# EAGLE design CYPRESS_SRAM_DB (EAGLE 9.6.2)
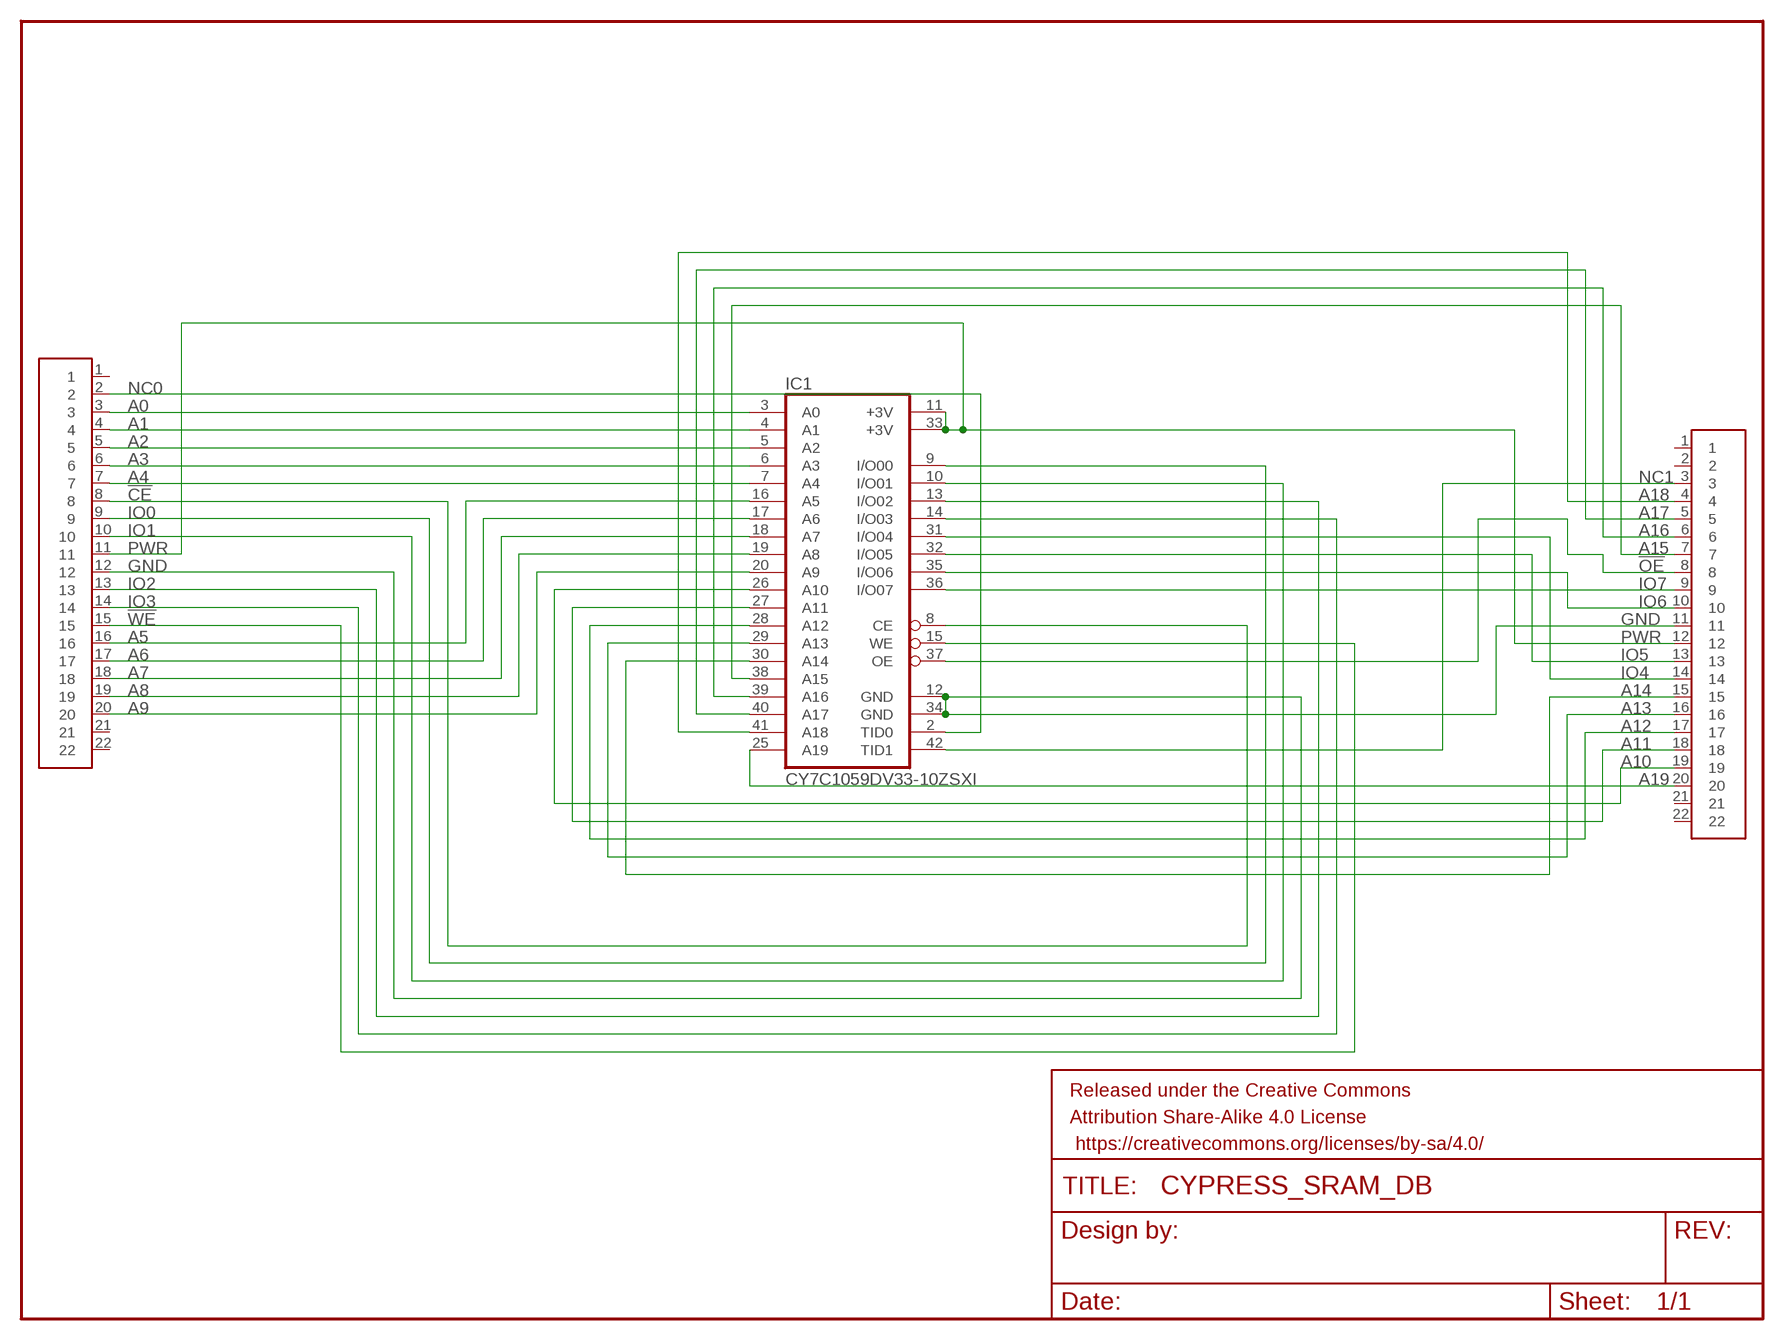
[diagram p0: schematic, sheet 1]

## Parts
FRAME1  FRAME-LETTERNO_PACKAGE  [DUMMY]
IC1  CY7C1059DV33-10ZSXI  [TSOPII-Z44]
U$1  1X22THM  [1X22]
U$2  1X22THM  [1X22]

## Nets
!CE: IC1.8(CE) U$2.8
!OE: IC1.37(OE) U$1.8
!WE: IC1.15(WE) U$2.15
A0: IC1.3(A0) U$2.3
A1: IC1.4(A1) U$2.4
A2: IC1.5(A2) U$2.5
A3: IC1.6(A3) U$2.6
A4: IC1.7(A4) U$2.7
A5: IC1.16(A5) U$2.16
A6: IC1.17(A6) U$2.17
A7: IC1.18(A7) U$2.18
A8: IC1.19(A8) U$2.19
A9: IC1.20(A9) U$2.20
A10: IC1.26(A10) U$1.19
A11: IC1.27(A11) U$1.18
A12: IC1.28(A12) U$1.17
A13: IC1.29(A13) U$1.16
A14: IC1.30(A14) U$1.15
A15: IC1.38(A15) U$1.7
A16: IC1.39(A16) U$1.6
A17: IC1.40(A17) U$1.5
A18: IC1.41(A18) U$1.4
A19: IC1.25(A19) U$1.20
GND: IC1.12(GND) IC1.34(GND) U$1.11 U$2.12
IO0: IC1.9(I/O00) U$2.9
IO1: IC1.10(I/O01) U$2.10
IO2: IC1.13(I/O02) U$2.13
IO3: IC1.14(I/O03) U$2.14
IO4: IC1.31(I/O04) U$1.14
IO5: IC1.32(I/O05) U$1.13
IO6: IC1.35(I/O06) U$1.10
IO7: IC1.36(I/O07) U$1.9
NC0: IC1.2(TID0) U$2.2
NC1: IC1.42(TID1) U$1.3
PWR: IC1.11(+3V) IC1.33(+3V) U$1.12 U$2.11
Unconnected: U$1.1 U$1.2 U$1.21 U$1.22 U$2.1 U$2.21 U$2.22

## Library data of the parts
FRAME1 = SparkFun-Aesthetics:FRAME-LETTER: Schematic Frame - Letter Standard 8.5x11 US Letter frame; DESIGNER: Nobody; VERSION: v01
IC1 = CYPRESS_SRAM_TID:CY7C1059DV33: Source: CYPRESS cy7c1059dv33_8.pdf
U$1 U$2 = adafruit:1X22

## Board
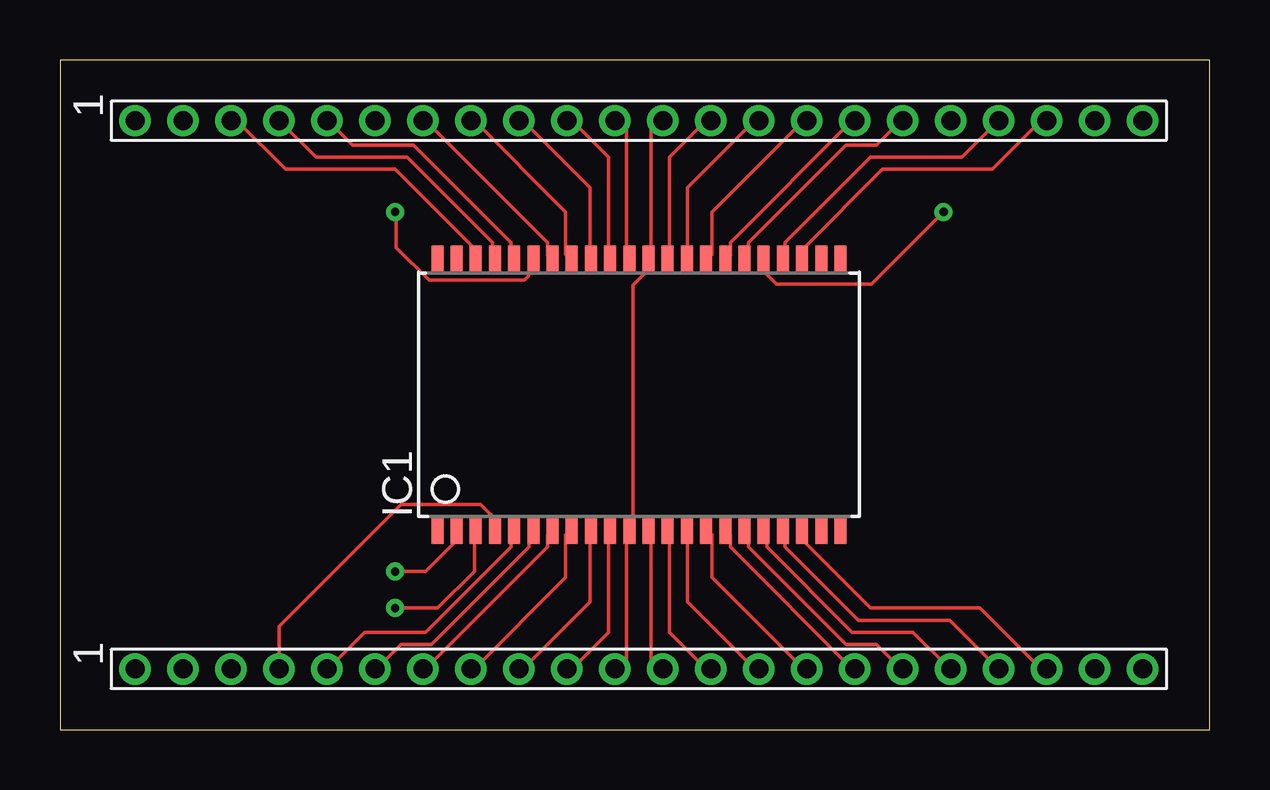
[diagram p1: board, top side]
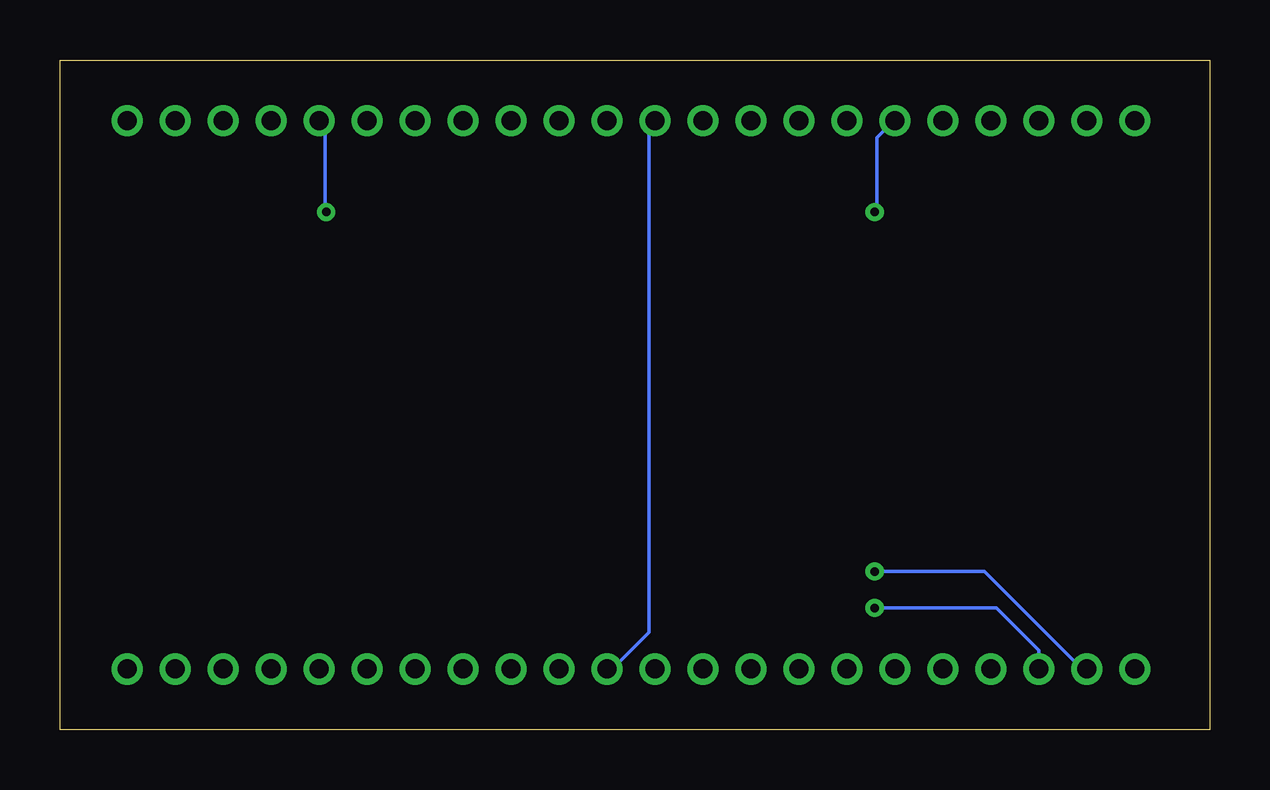
[diagram p2: board, bottom side, seen from below]

Size 47.93 x 27.93 mm. Coordinates in mm from the lower left corner, seen from the top.
Outline: 0,0 47.93,0 47.93,27.93 0,27.93 0,0
Copper layers (1*16): Top 0.035mm / dielectric 1.5mm / Bottom 0.035mm
Design rules "default": minimum track width 6mil, minimum drill 0.35mm, track to track 6mil, track to pad 6mil, pad to pad 6mil, via to via 6mil, smd to smd 6mil, copper to edge 40mil, drill to drill 6mil, minimum pad ring 10mil, minimum via ring 8mil, stop-mask expansion 4mil, vias tented up to drill 0mil, thermal gap 10mil

### Footprints (pad centres in the part's own frame; a part is rotated, then mirrored left to right if it is on the bottom)
TSOPII-Z44 = smd 0.5 x 1.2: 1 -8.4,-5.627; 2 -7.6,-5.627; 3 -6.8,-5.627; 4 -6,-5.627; 5 -5.2,-5.627; 6 -4.4,-5.627; 7 -3.6,-5.627; 8 -2.8,-5.627; 9 -2,-5.627; 10 -1.2,-5.627; 11 -0.4,-5.627; 12 0.4,-5.627; 13 1.2,-5.627; 14 2,-5.627; 15 2.8,-5.627; 16 3.6,-5.627; 17 4.4,-5.627; 18 5.2,-5.627; 19 6,-5.627; 20 6.8,-5.627; 21 7.6,-5.627; 22 8.4,-5.627; 23 8.4,5.627; 24 7.6,5.627; 25 6.8,5.627; 26 6,5.627; 27 5.2,5.627; 28 4.4,5.627; 29 3.6,5.627; 30 2.8,5.627; 31 2,5.627; 32 1.2,5.627; 33 0.4,5.627; 34 -0.4,5.627; 35 -1.2,5.627; 36 -2,5.627; 37 -2.8,5.627; 38 -3.6,5.627; 39 -4.4,5.627; 40 -5.2,5.627; 41 -6,5.627; 42 -6.8,5.627; 43 -7.6,5.627; 44 -8.4,5.627
1X22 = drill 0.8: 1 -21,0; 2 -19,0; 3 -17,0; 4 -15,0; 5 -13,0; 6 -11,0; 7 -9,0; 8 -7,0; 9 -5,0; 10 -3,0; 11 -1,0; 12 1,0; 13 3,0; 14 5,0; 15 7,0; 16 9,0; 17 11,0; 18 13,0; 19 15,0; 20 17,0; 21 19,0; 22 21,0

### Placement (x,y rotation side)
FRAME1  -13.97,29.21 0 top  (outside the outline)
IC1  24.13,13.97 0 top
U$1  24.13,25.4 0 top
U$2  24.13,2.54 0 top

### Tracks (layer width: path | path; a pad name or v marks a point on that pad's centre or on a via)
!CE
  Top 0.152: IC1.8 21.08,8.13 21.08,6.35 17.27,2.54 U$2.8
!OE
  Top 0.152: IC1.37 21.08,19.81 21.08,21.59 17.27,25.4 U$1.8
!WE
  Top 0.152: IC1.15 27.18,8.13 27.18,6.35 30.99,2.54 U$2.15
A0  (via drill 0.35)
  Top 0.152: IC1.3 17.27,8.13 17.27,6.6 15.75,5.08 v13.97,5.08
  Bottom 0.152: v13.97,5.08 8.89,5.08 7.13,3.32 U$2.3
A1
  Top 0.152: IC1.4 18.03,8.38 18.03,8.89 17.53,9.4 14.22,9.4 9.14,4.32 9.14,2.54 U$2.4
A2
  Top 0.152: IC1.5 18.8,8.13 18.8,7.62 15.24,4.06 12.7,4.06 11.18,2.54 U$2.5
A3
  Top 0.152: IC1.6 19.56,8.13 19.56,7.62 15.49,3.56 14.22,3.56 13.21,2.54 U$2.6
A4
  Top 0.152: IC1.7 20.32,8.13 20.32,7.62 15.24,2.54 U$2.7
A5
  Top 0.152: IC1.16 27.94,8.13 27.94,7.62 33.02,2.54 U$2.16
A6
  Top 0.152: IC1.17 28.7,8.13 28.7,7.62 32.77,3.56 34.04,3.56 35.05,2.54 U$2.17
A7
  Top 0.152: IC1.18 29.46,8.13 29.46,7.62 33.02,4.06 35.56,4.06 37.08,2.54 U$2.18
A8
  Top 0.152: IC1.19 30.23,8.13 30.23,7.62 33.27,4.57 37.08,4.57 39.12,2.54 U$2.19
A9
  Top 0.152: IC1.20 30.99,8.13 30.99,7.87 33.78,5.08 38.35,5.08 40.89,2.54 U$2.20
A10
  Top 0.152: IC1.26 30.23,19.81 30.23,20.32 33.78,23.88 37.59,23.88 39.12,25.4 U$1.19
A11  (via drill 0.35)
  Top 0.152: v36.83,21.59 33.83,18.59 29.87,18.59 29.41,19.05 IC1.27
  Bottom 0.152: v36.83,21.59 36.88,21.64 36.88,25.15 37.03,25.3 U$1.18
A12
  Top 0.152: IC1.28 28.7,19.81 28.7,20.32 32.77,24.38 34.04,24.38 35.05,25.4 U$1.17
A13
  Top 0.152: IC1.29 27.94,19.81 27.94,20.32 33.02,25.4 U$1.16
A14
  Top 0.152: IC1.30 27.18,19.81 27.18,21.59 30.99,25.4 U$1.15
A15
  Top 0.152: IC1.38 20.32,19.81 20.32,20.32 15.24,25.4 U$1.7
A16  (via drill 0.35)
  Top 0.152: IC1.39 19.73,19.45 19.51,18.9 19.36,18.75 15.39,18.75 14.02,20.12 14.02,21.49 v13.97,21.59
  Bottom 0.152: v13.97,21.59 13.87,21.64 13.87,24.69 13.26,25.3 U$1.6
A17
  Top 0.152: IC1.40 18.8,19.81 18.8,20.32 14.73,24.38 12.19,24.38 11.18,25.4 U$1.5
A18
  Top 0.152: IC1.41 18.03,19.81 18.03,20.32 14.48,23.88 10.67,23.88 9.14,25.4 U$1.4
A19
  Top 0.152: IC1.25 30.99,19.81 30.99,20.07 34.29,23.37 38.86,23.37 40.89,25.4 U$1.20
GND
  Top 0.152: IC1.34 23.62,19.81 23.62,25.15 23.37,25.4 U$1.11 | IC1.12 24.64,8.13 24.64,2.79 24.89,2.54 U$2.12
  Bottom 0.152: U$1.11 23.37,25.4 23.37,4.06 24.89,2.54 U$2.12
IO0
  Top 0.152: IC1.9 22.1,8.13 22.1,5.33 19.3,2.54 U$2.9
IO1
  Top 0.152: IC1.10 22.86,8.13 22.86,4.06 21.34,2.54 U$2.10
IO2
  Top 0.152: IC1.13 25.4,8.13 25.4,4.06 26.92,2.54 U$2.13
IO3
  Top 0.152: IC1.14 26.16,8.13 26.16,5.33 28.96,2.54 U$2.14
IO4
  Top 0.152: IC1.31 26.16,19.81 26.16,22.61 28.96,25.4 U$1.14
IO5
  Top 0.152: IC1.32 25.4,19.81 25.4,23.88 26.92,25.4 U$1.13
IO6
  Top 0.152: IC1.35 22.86,19.81 22.86,23.88 21.34,25.4 U$1.10
IO7
  Top 0.152: IC1.36 22.1,19.81 22.1,22.61 19.3,25.4 U$1.9
NC0  (via drill 0.35)
  Top 0.152: 16.51,7.87 16.51,8.13 IC1.2 16.51,7.87 | 16.51,7.87 15.24,6.6 v13.97,6.6
  Bottom 0.152: v13.97,6.6 9.4,6.6 5.33,2.54 U$2.2
NC1
  Top 0.152: IC1.42 17.27,19.81 17.27,20.07 13.97,23.37 9.4,23.37 7.37,25.4 U$1.3
PWR
  Top 0.152: U$2.11 23.37,2.54 23.62,2.79 23.62,8.13 IC1.11 23.88,8.38 23.88,18.54 24.38,19.05 24.38,19.56 IC1.33 24.64,19.81 24.64,25.15 24.89,25.4 U$1.12